# EAGLE design LilyPad_XBee (EAGLE 6.5.0)
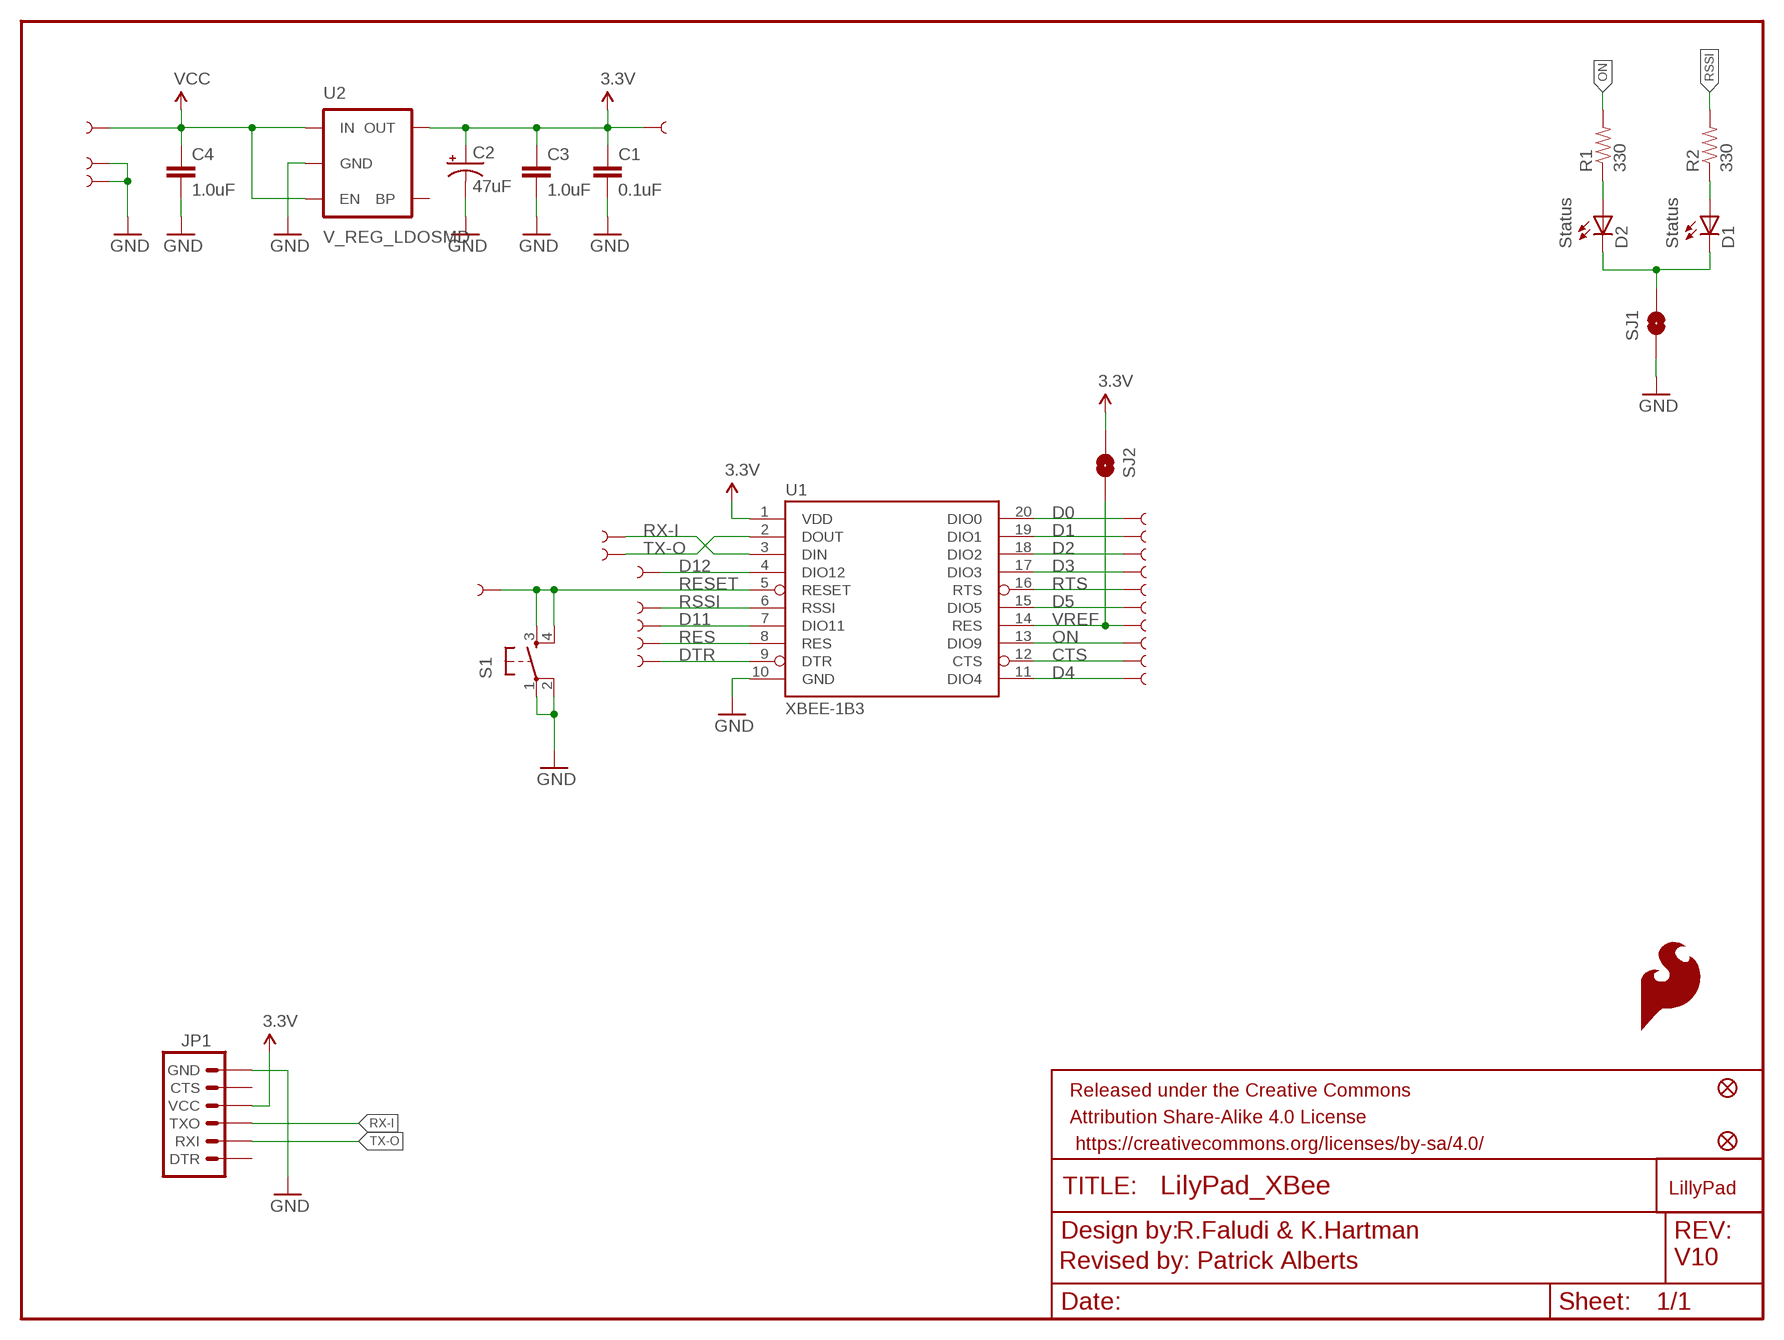
[diagram p0: schematic, sheet 1]

## Parts
C1  0.1uF  0.1UF-25V(+80/-20%)(0603)  [0603-CAP]
C2  47uF  CAP_POL3528  [EIA3528]
C3  1.0uF  1.0UF-16V-10%(0603)  [0603-CAP]
C4  1.0uF  1.0UF-16V-10%(0603)  [0603-CAP]
D1  Status  LED-GREEN0603  [LED-0603]
D2  Status  LED-RED0603  [LED-0603]
FID1  FIDUCIAL1X2  [FIDUCIAL-1X2]
FID2  FIDUCIAL1X2  [FIDUCIAL-1X2]
FRAME1  FRAME-LETTER  [CREATIVE_COMMONS]
GND  SEWTAP9  [PETAL-LONG-1-2SIDE]
JP1  ARDUINO_SERIAL_PROGRAMPTH  [1X06]
LOGO1  SFE_LOGO_FLAME.1COP  [SFE_LOGO_FLAME_COPPER_.1]
R1  330  330OHM1/10W1%(0603)  [0603-RES]
R2  330  330OHM1/10W1%(0603)  [0603-RES]
S1  TAC_SWITCHSMD  [TACTILE_SWITCH_SMD]
SJ1  SOLDERJUMPERNC2  [SJ_2S-NOTRACE]
SJ2  SOLDERJUMPERNC2  [SJ_2S-NOTRACE]
U1  XBEE-1B3  [XBEE-SMD]
U2  V_REG_LDOSMD  [SOT23-5]
U$1  LOGO-LPLP  [LOGO-LILYPAD]
U$4  SEWTAP9  [PETAL-LONG-1-2SIDE]
U$30  SEWTAP9  [PETAL-LONG-1-2SIDE]
U$31  SEWTAP9  [PETAL-LONG-1-2SIDE]
U$32  SEWTAP9  [PETAL-LONG-1-2SIDE]
U$33  SEWTAP9  [PETAL-LONG-1-2SIDE]
U$34  SEWTAP9  [PETAL-LONG-1-2SIDE]
U$35  SEWTAP9  [PETAL-LONG-1-2SIDE]
U$36  SEWTAP9  [PETAL-LONG-1-2SIDE]
U$37  SEWTAP9  [PETAL-LONG-1-2SIDE]
U$38  SEWTAP9  [PETAL-LONG-1-2SIDE]
U$39  SEWTAP9  [PETAL-LONG-1-2SIDE]
U$40  SEWTAP9  [PETAL-LONG-1-2SIDE]
U$41  SEWTAP9  [PETAL-LONG-1-2SIDE]
U$42  SEWTAP9  [PETAL-LONG-1-2SIDE]
U$43  SEWTAP9  [PETAL-LONG-1-2SIDE]
U$44  SEWTAP9  [PETAL-LONG-1-2SIDE]
U$45  SEWTAP9  [PETAL-LONG-1-2SIDE]
U$46  SEWTAP9  [PETAL-LONG-1-2SIDE]
U$47  SEWTAP9  [PETAL-LONG-1-2SIDE]
U$48  SEWTAP9  [PETAL-LONG-1-2SIDE]
U$51  SEWTAP9  [PETAL-LONG-1-2SIDE]

## Nets
3.3V: C1.1 C2.A(+) C3.1 JP1.4(VCC) SJ2.1 U1.1(VDD) U2.5(OUT) U$47.1
CTS: U1.12(CTS) U$38.1
D0: U1.20(DIO0) U$34.1
D1: U1.19(DIO1) U$33.1
D2: U1.18(DIO2) U$32.1
D3: U1.17(DIO3) U$31.1
D4: U1.11(DIO4) U$37.1
D5: U1.15(DIO5) U$4.1
D11: U1.7(DIO11) U$42.1
D12: U1.4(DIO12) U$43.1
DTR: U1.9(DTR) U$48.1
GND [VCC]: C1.2 C2.C(-) C3.2 C4.2 JP1.6(GND) S1.1 S1.2 SJ1.1 U1.10(GND) U2.2(GND) U$36.1 U$46.1
N$1: D1.A R2.1
N$2: D2.A R1.1
N$3: D1.C D2.C SJ1.2
ON: R1.2 U1.13(DIO9) U$39.1
RES: U1.8(RES) U$41.1
RESET: GND.1 S1.3 S1.4 U1.5(RESET)
RSSI: R2.2 U1.6(RSSI) U$51.1
RTS: U1.16(RTS) U$30.1
RX-I: JP1.3(TXO) U1.3(DIN) U$45.1
TX-O: JP1.2(RXI) U1.2(DOUT) U$44.1
VCC [VCC]: C4.1 U2.1(IN) U2.3(EN) U$35.1
VREF: SJ2.2 U1.14(RES) U$40.1
Unconnected: JP1.1(DTR) JP1.5(CTS) U2.4(BP)

## Notes on the sheet
- R.Faludi & K.Hartman
- Revised by: Patrick Alberts | V10

## Library data of the parts
C1 = SparkFun-Capacitors:0.1UF-25V(+80/-20%)(0603): CAP-00810 Ceramic Standard decoupling cap; PROD_ID: CAP-00810
C2 = SparkFun:CAP_POL: Capacitor Polarized These are standard SMD and PTH capacitors. Normally 10uF, 47uF, and 100uF in electrolytic and tantalum varieties. Always verify the external diameter of the through hole cap, it varies with capacity, voltage, and manufacturer. The EIA devices should be standard.
C3 C4 = SparkFun-Capacitors:1.0UF-16V-10%(0603): CAP-00868; PROD_ID: CAP-00868
D1 = SparkFun-LED:LED-GREEN: Various green LEDs Green LEDs used in SFE Production 0603- DIO-00821 LARGE- DIO-00862 LILYPAD- DIO-09910; PROD_ID: DIO-00821; VALUE: GREEN
D2 = SparkFun-LED:LED-RED: Assorted Red LEDs LilyPad 1206- DIO-09912 1206- DIO-00809 0603- DIO-00819; PROD_ID: DIO-00819; VALUE: RED
FID1 FID2 = SparkFun-Aesthetics:FIDUCIAL: Fiducial Alignment Points Various fiducial points for machine vision alignment.
FRAME1 = SparkFun-Aesthetics:FRAME-LETTER: Schematic Frame Standard 8.5x11 US Letter frame
GND U$4 U$30-U$48 U$51 = LilyPad-Wearables:SEWTAP
JP1 = SparkFun:ARDUINO_SERIAL_PROGRAM
LOGO1 = SparkFun-Aesthetics:SFE_LOGO_FLAME: SFE Logo, flame only This is the SparkFun flame logo. The logo on the schematic will always be the same size; the package variant is the height of the flame. Default layer for the logo on the board is tSilk.
R1 R2 = SparkFun-Resistors:330OHM1/10W1%(0603): RES-00818; PROD_ID: RES-00818
S1 = SparkFun-Electromechanical:TAC_SWITCH: Momentary Switch Button commonly used for reset or general input. Spark Fun Electronics SKU : COM-00097 SMT- SWCH-08247; PROD_ID: SWCH-08247
SJ1 SJ2 = SparkFun:SOLDERJUMPER: Solder Jumper Standard SMD solder jumper. Used to automate production. Two varients : Normally Open and Normally Closed are the same, but have different paste layers. NC will have a large amount of paste and should jumper during reflow.
U1 = SparkFun:XBEE-1
U2 = SparkFun:V_REG_LDO: Voltage Regulator LDO Standard 150mA LDO voltage regulator in SOT-23 layout. Micrel part MIC5205. BP (by-pass) pin is used to lower output noise with 470pF cap.
U$1 = LilyPad-Wearables:LOGO-LP

## Net classes
0 Default: width 0.203 mm
1 VCC: width 0.305 mm

## Board
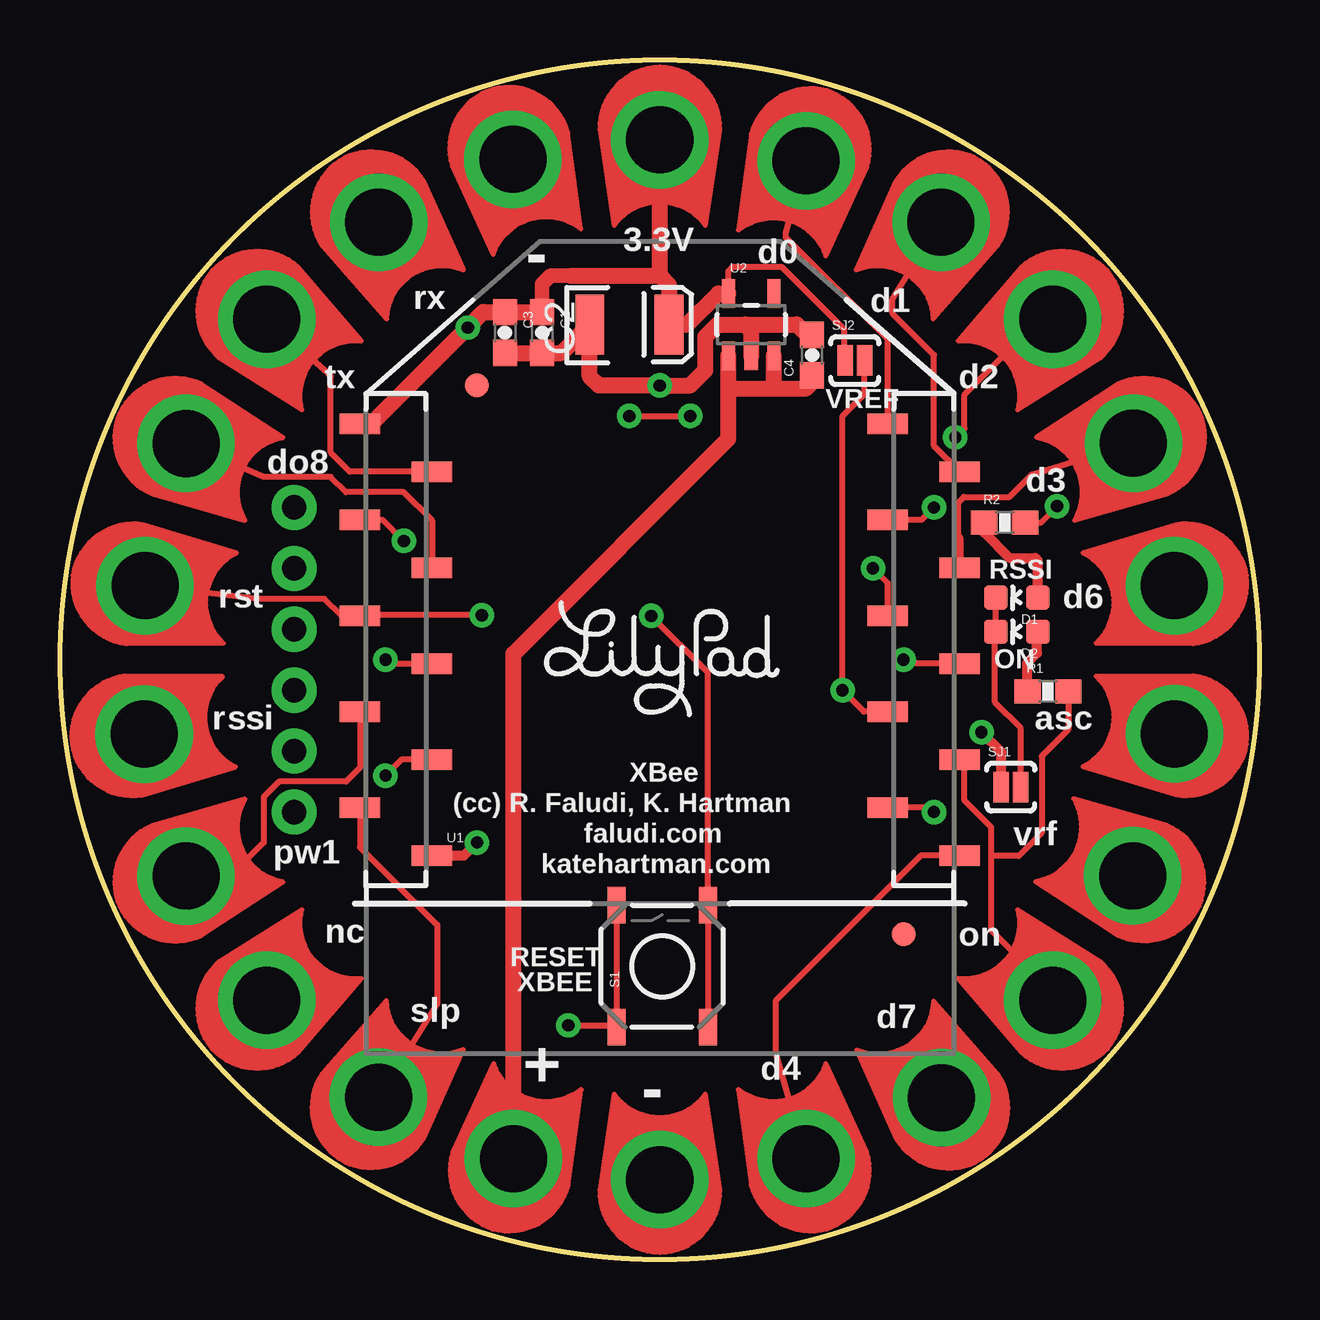
[diagram p1: board, top side]
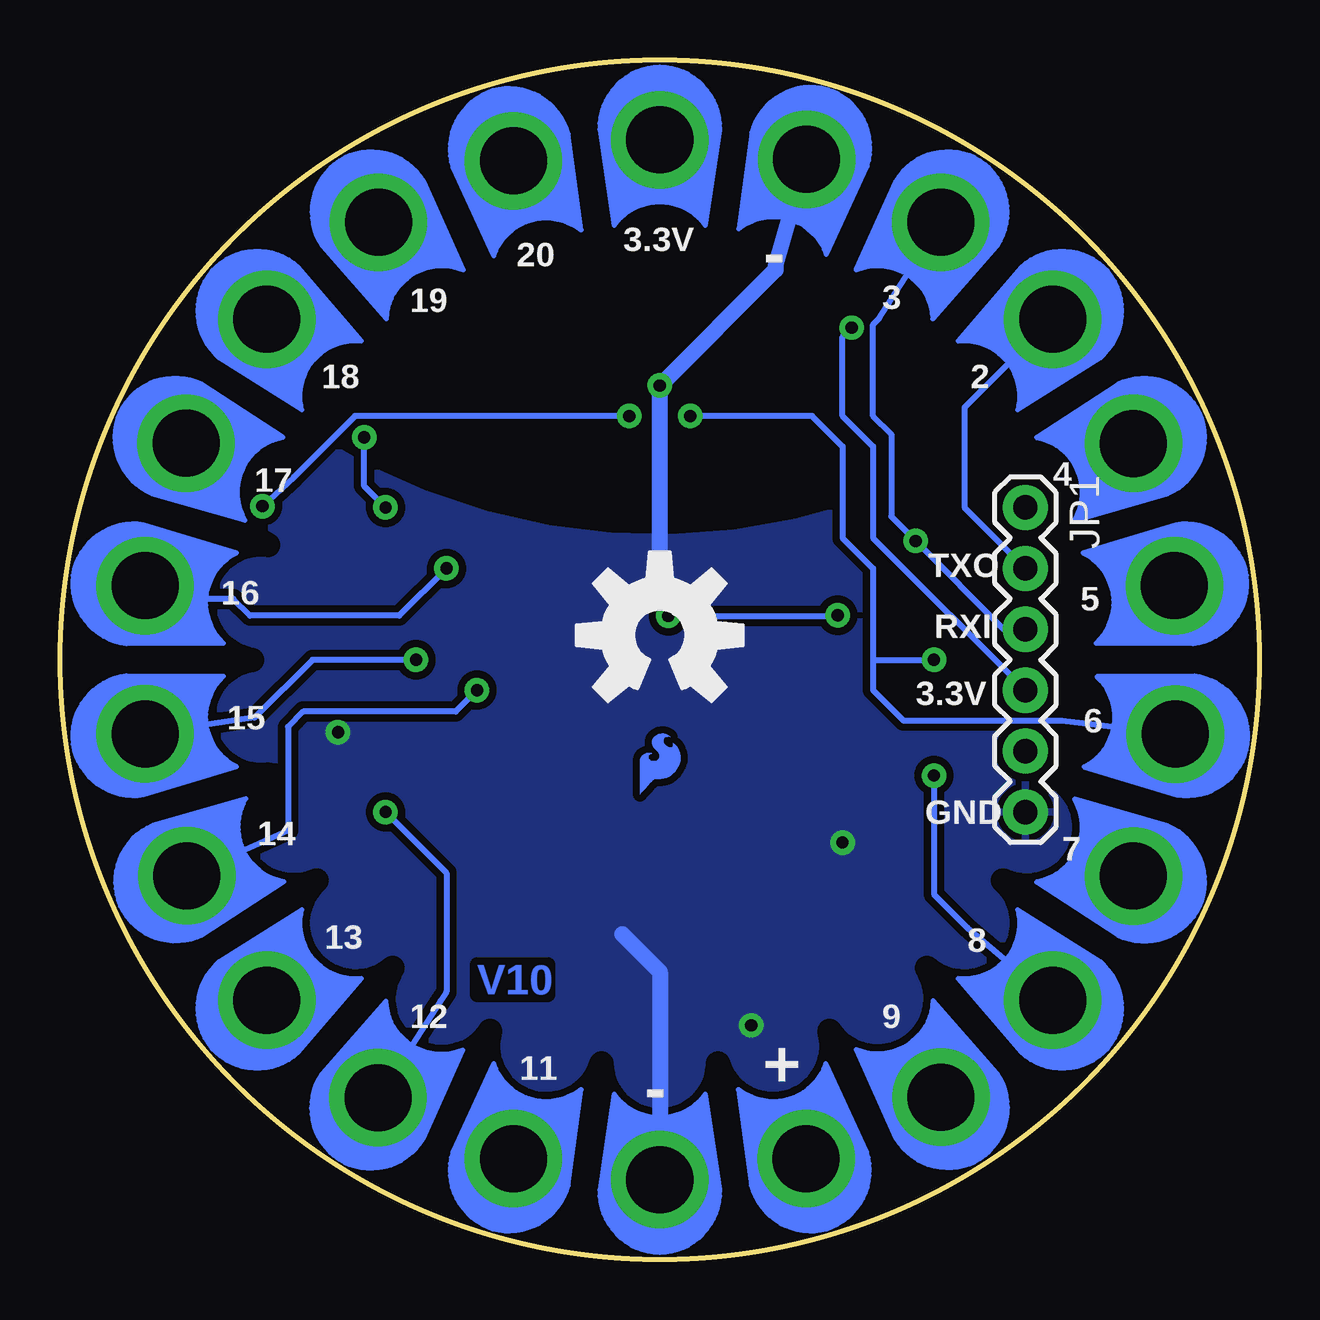
[diagram p2: board, bottom side, seen from below]

Size 50 x 50 mm. Coordinates in mm from the lower left corner, seen from the top.
Outline: circle at 25,25 radius 25
Copper layers (1*16): Top 0.035mm / dielectric 1.5mm / Bottom 0.035mm
Design rules "SparkFun-2-layer": minimum track width 7mil, minimum drill 15mil, track to track 8mil, track to pad 8mil, pad to pad 8mil, via to via 8mil, smd to smd 8mil, copper to edge 8mil, drill to drill 8mil, minimum pad ring 12mil, minimum via ring 10mil, stop-mask expansion 4mil, vias tented up to drill 20mil, thermal gap 10mil
bRestrict: area 2.4,2.4 to 47.6,47.6; area 21,42.8 to 23.5,44; area 31.6,41.3 to 34.4,43; area 36.3,38.4 to 38.9,40.7; area 40,34.1 to 42,36.9; area 42.2,29.2 to 43.6,31.8; area 42.8,23.9 to 44,26.2; area 42.2,18.2 to 43.7,20.9; area 36.3,9.4 to 39,11.7; area 31.7,7 to 34.5,8.7; area 26.5,6 to 28.9,7.3; area 21.1,6 to 23.6,7.3; area 15.6,7 to 18.3,8.7; area 11,9.3 to 13.8,11.6; area 8,13.1 to 10.1,15.9; area 6.4,18.2 to 8,20.8; area 6,23.7 to 7.2,26.2; area 6.3,29.1 to 7.9,31.7; area 8,34 to 10.1,36.9; area 11,38.3 to 13.7,40.6; area 15.4,41.2 to 18.4,43; area 26.4,42.5 to 29.1,44; area 40,13 to 42,16.1; 22 lines

### Footprints (pad centres in the part's own frame; a part is rotated, then mirrored left to right if it is on the bottom)
0603-CAP = smd 1.1 x 1: 1 -0.85,0; 2 0.85,0
EIA3528 = smd 1.2 x 2.5: A 1.65,0; C -1.65,0
LED-0603 = smd 1 x 1: A 0,-0.877; C 0,0.877
FIDUCIAL-1X2 = smd 1 x 1: 1 0,0
PETAL-LONG-1-2SIDE = drill 2.794 pad 4.064: 1 0.03,0
1X06 = drill 1.016 pad 1.88: 1 0,0; 2 2.54,0; 3 5.08,0; 4 7.62,0; 5 10.16,0; 6 12.7,0
0603-RES = smd 1.1 x 1: 1 -0.85,0; 2 0.85,0
TACTILE_SWITCH_SMD = smd 1.524 x 0.762: 1 -2.54,1.905; 2 2.54,1.905; 3 -2.54,-1.905; 4 2.54,-1.905
SJ_2S-NOTRACE = smd 0.635 x 1.27: 1 -0.401,0; 2 0.413,0
XBEE-SMD = smd 1.7 x 0.85: 1 -12.5,20; 2 -9.5,18; 3 -12.5,16; 4 -9.5,14; 5 -12.5,12; 6 -9.5,10; 7 -12.5,8; 8 -9.5,6; 9 -12.5,4; 10 -9.5,2; 11 12.5,2; 12 9.5,4; 13 12.5,6; 14 9.5,8; 15 12.5,10; 16 9.5,12; 17 12.5,14; 18 9.5,16; 19 12.5,18; 20 9.5,20
SOT23-5 = smd 0.55 x 1.2: 1 -0.95,-1.3; 2 0,-1.3; 3 0.95,-1.3; 4 0.95,1.3; 5 -0.95,1.3

### Placement (x,y rotation side)
C1  20.1,38.64 270 top
C2  23.73,38.97 0 top
C3  18.55,38.64 270 top
C4  31.35,37.7 90 top
D1  39.88,27.59 90 top
D2  39.88,26.17 90 top
FID1  17.38,36.43 0 top
FID2  35.16,13.57 0 top
FRAME1  -2.16,-11.83 0 top  (outside the outline)
GND  3.52,28.09 351.8 top
JP1  9.76,31.35 270 bottom
LOGO1  26.14,19.03 0 bottom
R1  41.18,23.68 0 top
R2  39.38,30.71 0 top
S1  25.1,12.22 90 top
SJ1  39.63,19.69 0 top
SJ2  33.13,37.47 0 top
U1  25,14.84 0 top
U2  28.81,38.97 0 top
U$1  25.13,25.38 0 top
U$2  [OSHW-LOGO-L]  25,26.02 0 bottom
U$4  46.48,21.91 171.8 top
U$30  46.48,28.09 188.2 top
U$31  44.77,34.04 204.5 top
U$32  41.4,39.21 220.9 top
U$33  36.74,43.26 237.3 top
U$34  31.11,45.83 253.7 top
U$35  18.89,4.17 73.7 top
U$36  25,3.3 90 top
U$37  31.11,4.17 106.3 top
U$38  36.76,6.72 122.7 top
U$39  41.4,10.79 139.1 top
U$40  44.74,15.98 155.5 top
U$41  8.6,10.79 40.9 top
U$42  5.23,15.97 24.5 top
U$43  5.23,34.03 335.5 top
U$44  8.6,39.21 319.1 top
U$45  13.27,43.26 302.7 top
U$46  18.87,45.89 286.3 top
U$47  25,46.7 270 top
U$48  13.26,6.74 57.3 top
U$51  3.48,21.9 8.2 top

### Tracks (layer width: path | path; a pad name or v marks a point on that pad's centre or on a via)
3.3V  (via drill 0.51)
  Top 0.254: U2.5 27.86,41.2 28.05,41.38 30.08,41.38 32.68,38.78 32.68,37.52 SJ2.1
  Top 0.61: 21.32,41 20.45,41 20.1,40.65 C1.1
  Top 0.66: C2.A 25.25,38.97 | U2.5 27.44,40.27 26.14,38.97 C2.A | C2.A 25.38,40.62 25,41 | 21.32,41 25,41 | 25,41 U$47.1 | U1.1 13,34.84 v17,38.84 17.65,39.49 C3.1 C1.1
  Bottom 0.254: JP1.4 16.11,30.08 16.11,33.89 17.38,35.16 17.38,38.46 v17,38.84
CTS  (via drill 0.51)
  Top 0.254: U1.12 36.24,18.84 v36.43,18.65
  Bottom 0.254: U$38.1 34.14,10.78 33.89,11.16 33.89,16.11 v36.43,18.65
D0
  Top 0.254: U$34.1 30.26,42.8 30.26,42.6 34.5,38.36 U1.20
D1
  Top 0.254: U$33.1 34.7,40.03 34.7,39.43 36.43,37.7 36.43,33.91 U1.19
D2  (via drill 0.51)
  Top 0.254: U1.18 35.92,30.84 v36.43,31.35 | U$32.1 40.84,39.19 37.7,36.05 37.7,34.65 v37.32,34.27
  Bottom 0.254: v36.43,31.35 37.32,32.24 v37.32,34.27
D3
  Top 0.254: 37.45,30.08 37.45,31.55 37.67,31.78 39.58,31.78 40.52,32.72 U$31.1
  Top 0.406: 37.45,30.08 37.45,28.89 U1.17
D4
  Top 0.254: U$37.1 29.83,8.62 29.83,10.78 35.89,16.84 U1.11
D5  (via drill 0.51)
  Top 0.254: U1.15 35.32,24.84 v35.16,25
  Bottom 0.254: U$4.1 41.89,22.59 39.48,25 v35.16,25
D11
  Top 0.254: U1.7 12.5,20.5 11.92,19.92 9.12,19.92 8.49,19.29 8.49,17.38 7.09,15.98 U$42.1
D12
  Top 0.254: U$43.1 8.49,32.62 11.28,32.62 11.92,31.98 14.33,31.98 15.5,30.82 U1.4
DTR
  Top 0.254: U$48.1 15.73,10.65 15.73,13.95 12.5,17.18 U1.9
GND  (via drill 0.51)
  Top 0.254: v21.19,9.76 23.12,9.76 S1.1 S1.2
  Top 0.406: U1.10 16.84,16.84 v17.38,17.38 | SJ1.1 39.23,21.16 v38.41,21.98
  Top 0.66: C2.C | U2.2 28.81,38.72 28.56,38.97 | 28.56,38.97 27.41,38.97 26.91,38.46 26.91,37.06 26.27,36.43 v25,36.43 22.46,36.43 22.08,36.81 C2.C | C4.2 31.35,38.34 30.71,38.97 28.56,38.97 | C3.2 C1.2 20.9,37.79 C2.C
  Bottom 0.66: 25,28.81 v25,36.43 20.17,41.26 20.17,41.38 U$46.1 | U$36.1 25,12 26.57,13.57
  pour Bottom (isolate 0.305): -1,52.27 arc159 51,51 51,-1 -1,-1
N$1
  Top 0.406: R2.1 38.53,30.3 39.58,29.24 40.65,29.24 40.75,29.14 40.75,27.6 D1.A
N$2
  Top 0.406: R1.1 40.33,24.89 40.72,25.28 40.72,26.13 D2.A
N$3
  Top 0.254: D1.C D2.C 38.97,26.13 38.97,23.22 40.04,22.15 SJ1.2
ON
  Top 0.254: U$39.1 41.38,11.16 38.82,13.72 38.82,16.82 | 38.82,16.82 38.82,18.02 37.7,19.13 37.7,20.64 U1.13 | R1.2 42.03,22.09 40.93,20.99 40.93,17.79 39.96,16.82 38.82,16.82
RES  (via drill 0.51)
  Top 0.254: U1.8 14.24,20.84 v13.57,20.17
  Bottom 0.254: U$41.1 12.17,13.82 13.57,15.22 v13.57,20.17
RESET  (via drill 0.51)
  Top 0.254: GND.1 8.24,27.54 11.03,27.54 11.73,26.84 U1.5 12.51,26.85 v17.58,26.85 | S1.3 S1.4 27.01,24.47 v24.64,26.83
  Bottom 0.254: v24.64,26.83 17.61,26.83 v17.58,26.85
RSSI  (via drill 0.51)
  Top 0.254: v23.73,35.16 v26.27,35.16 | U1.6 13.73,24.84 v13.57,25 | R2.2 40.88,30.71 v41.56,31.4
  Bottom 0.254: v41.56,31.4 40.24,32.62 37.7,35.16 v26.27,35.16 | v23.73,35.16 18.65,35.16 17.38,33.89 17.38,30.08 16.11,28.81 16.11,25 | U$51.1 8.24,22.46 14.84,22.46 16.11,23.73 16.11,25 | 16.11,25 v13.57,25
RTS  (via drill 0.51)
  Top 0.254: U1.16 34.5,28.2 v33.89,28.81
  Bottom 0.254: v33.89,28.81 35.86,26.84 42.08,26.84 42.78,27.54 45.91,27.54 U$30.1
RX-I  (via drill 0.51)
  Top 0.254: U1.3 13.45,30.84 v14.33,29.95
  Bottom 0.254: U$45.1 15.86,39.22 16.11,38.97 16.11,35.16 15.35,34.4 15.35,30.97 v14.33,29.95 10.65,26.27 JP1.3
TX-O
  Top 0.254: U$44.1 11.03,37.06 11.28,36.81 11.28,33.64 12.08,32.84 U1.2
  Bottom 0.254: JP1.2 12.3,31.35 12.3,35.51 U$44.1
VCC
  Top 0.66: 27.86,36.3 27.86,34.21 18.9,25.25 U$35.1 | 27.86,36.3 U2.1 | 29.76,36.3 U2.3 | C4.1 31.35,36.56 31.1,36.3 29.76,36.3 | 27.86,36.3 29.76,36.3
VREF  (via drill 0.51)
  Top 0.254: U1.14 33.51,22.84 v32.62,23.73 32.62,35.16 33.53,36.07 33.53,37.46 SJ2.2
  Top 0.406: U1.14 34.78,22.84
  Bottom 0.254: U$40.1 40.49,17.89 40.49,22.21 39.86,22.84 33.51,22.84 v32.62,23.73

### Text on the board
Bottom: V10
tPlace: 3.3V | d0 | - | rx | d1 | tx | VREF | d2 | do8 | d3 | RSSI | r | s | t | d6 | ON | r | s | s | i | asc | XBee | (cc) R. Faludi, K. Hartman | faludi.com | vrf | pw1 | katehartman.com | nc | on | RESET | XBEE | slp | d7 | + | d4 | -
bPlace: 3.3V | - | 20 | 3 | 19 | 2 | 18 | 4 | 17 | TXO | 5 | 16 | RXI | 3.3V | 6 | 15 | GND | 7 | 14 | 8 | 13 | 9 | 12 | + | 11 | -
tDocu: R.Faludi & K.Hartman | Revised by: Patrick Alberts